# EAGLE design Slave_l293d (EAGLE 9.2.2)
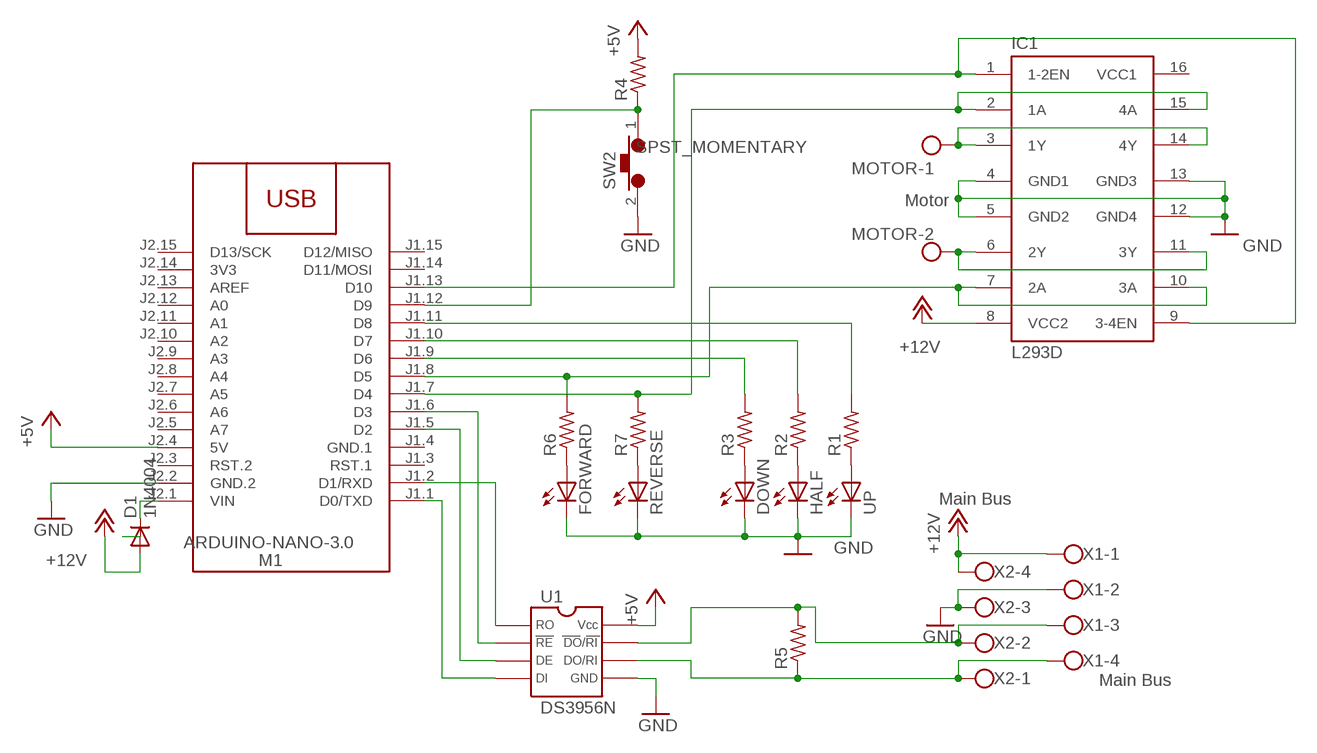
[diagram p0: schematic, sheet 1]

## Parts
D1  1N4004  [DO41-10]
DOWN  LED5MM  [LED5MM]
FORWARD  LED5MM  [LED5MM]
HALF  LED5MM  [LED5MM]
IC1  L293D  [DIL16]
M1  ARDUINO-NANO-3.0  [ARDUINO-NANO-3.0]
MOTOR  Motor  W237-102  [W237-102]
R1  FLIPFLOP-RES  [0805-THM]
R2  FLIPFLOP-RES  [0805-THM]
R3  FLIPFLOP-RES  [0805-THM]
R4  FLIPFLOP-RES  [0805-THM]
R5  FLIPFLOP-RES  [0805-THM]
R6  FLIPFLOP-RES  [0805-THM]
R7  FLIPFLOP-RES  [0805-THM]
REVERSE  LED5MM  [LED5MM]
SW2  SPST_MOMENTARY  [2PIN]
U1  DS3956N  [DIL08]
UP  LED5MM  [LED5MM]
X1  Main Bus  W237-4  [W237-4]
X2  Main Bus  W237-4  [W237-4]

## Nets
+5V: M1.J2.4(5V) R4.2 U1.8(VCC)
+12V: D1.A IC1.8(VCC2) X1.1 X2.4
GND: DOWN.K(C) FORWARD.K(C) HALF.K(C) IC1.4(GND1) IC1.5(GND2) IC1.12(GND4) IC1.13(GND3) M1.J2.2(GND.2) REVERSE.K(C) SW2.2 U1.5(GND) UP.K(C) X1.2 X2.3
N$1: R1.1 UP.A
N$2: HALF.A R2.1
N$3: DOWN.A R3.1
N$4: M1.J1.12(D9) R4.1 SW2.1
N$5: R5.1 U1.6(DO/RI) X1.4 X2.1
N$6: R5.2 U1.7(_DO/RI_) X1.3 X2.2
N$7: M1.J1.6(D3) U1.2(_RE_)
N$8: M1.J1.5(D2) U1.3(DE)
N$9: M1.J1.2(D1/RXD) U1.1(RO)
N$10: M1.J1.1(D0/TXD) U1.4(DI)
N$11: M1.J1.9(D6) R3.2
N$12: M1.J1.10(D7) R2.2
N$13: M1.J1.11(D8) R1.2
N$16: D1.C M1.J2.1(VIN)
N$18: FORWARD.A R6.1
N$19: R7.1 REVERSE.A
N$20: IC1.2(1A) IC1.15(4A) M1.J1.7(D4) R7.2
N$21: IC1.3(1Y) IC1.14(4Y) MOTOR.1
N$22: IC1.1(1-2EN) IC1.9(3-4EN) M1.J1.13(D10)
N$24: IC1.6(2Y) IC1.11(3Y) MOTOR.2
N$25: IC1.7(2A) IC1.10(3A) M1.J1.8(D5) R6.2
Unconnected: M1.J1.3(RST.1) M1.J1.14(D11/MOSI) M1.J1.15(D12/MISO) M1.J2.3(RST.2) M1.J2.5(A7) M1.J2.6(A6) M1.J2.7(A5) M1.J2.8(A4) M1.J2.9(A3) M1.J2.10(A2) M1.J2.11(A1) M1.J2.12(A0) M1.J2.13(AREF) M1.J2.15(D13/SCK)

## Power pins joined to a net without a drawn wire
3V3: M1.J2.14(3V3)
GND.1: M1.J1.4(GND.1)
VCC1: IC1.16(VCC1)

## Library data of the parts
D1 = adafruit:1N4004: DIODE General purpose 1N400x type rectifier (With bigger pads) http://www.ladyada.net/library/pcb/eaglelibrary.html
DOWN FORWARD HALF REVERSE UP = adafruit:LED: LED OSRAM: - CHIPLED LG R971, LG N971, LY N971, LG Q971, LY Q971, LO R971, LY R971 LH N974, LH R974 LS Q976, LO Q976, LY Q976 LO Q996 - Hyper CHIPLED LW Q18S LB Q993, LB Q99A, LB R99A - SideLED LS A670, LO A670, LY A670, LG A670, LP A670 LB A673, LV A673, LT A673, LW A673 LH A674 LY A675 LS A676, LA A676, LO A676, LY A676, LW A676 LS A679, LY A679, LG A679 - Hyper Micro SIDELED® LS Y876, LA Y876, LO Y876, LY Y876 LT Y87S - SmartLED LW L88C, LW L88S LB L89C, LB L89S, LG L890 LS L89K, LO L89K, LY L89K LS L896, LA L896, LO L896, LY L896 - TOPLED LS T670, LO T670, LY T670, LG T670, LP T670 LSG T670, LSP T670, LSY T670, LOP T670, LYG T670 LG T671, LOG T671, LSG T671 LB T673, LV T673, LT T673, LW T673 LH T674 LS T676, LA T676, LO T676, LY T676, LB T676, LH T676, LSB T676, LW T676 LB T67C, LV T67C, LT T67C, LS T67K, LO T67K, LY T67K, LW E67C LS E67B, LA E67B, LO E67B, LY E67B, LB E67C, LV E67C, LT E67C LW T67C LS T679, LY T679, LG T679 LS T770, LO T770, LY T770, LG T770, LP T770 LB T773, LV T773, LT T773, LW T773 LH T774 LS E675, LA E675, LY E675, LS T675 LS T776, LA T776, LO T776, LY T776, LB T776 LHGB T686 LT T68C, LB T68C - Hyper Mini TOPLED® LB M676 - Mini TOPLED Santana® LG M470 LS M47K, LO M47K, LY M47K Source: http://www.osram.convergy.de/
IC1 = st-microelectronics:L293D: PUSH-PULL 4 CHANNEL DRIVER; MPN: L293D; OC_FARNELL: 9589619; OC_NEWARK: 56P8249
M1 = diy-modules:ARDUINO-NANO-3.0: Arduino Nano 3.0
MOTOR = con-wago-500:W237-102: WAGO SCREW CLAMP; MPN: 237-102; OC_FARNELL: unknown; OC_NEWARK: 70K9898
R1-R7 = adafruit:FLIPFLOP-RES: Flip Flop resistor An 0805 resistor inside a standard 1/4W 5% resistor. Makes for easy mods
SW2 = OffBoardSwitches:SPST_MOMENTARY: A 2 pin 0.1" header with a button symbol for mounting buttons off board with the correct symbol in the schematic
U1 = DS3695N_RS485_Transceiver:DS3956N: DS35695N rs485 Transiever
X1 X2 = con-wago-500:W237-4: WAGO SCREW CLAMP; OC_FARNELL: unknown; OC_NEWARK: unknown

## Net classes
0 default: width 0.025 mm

## Board
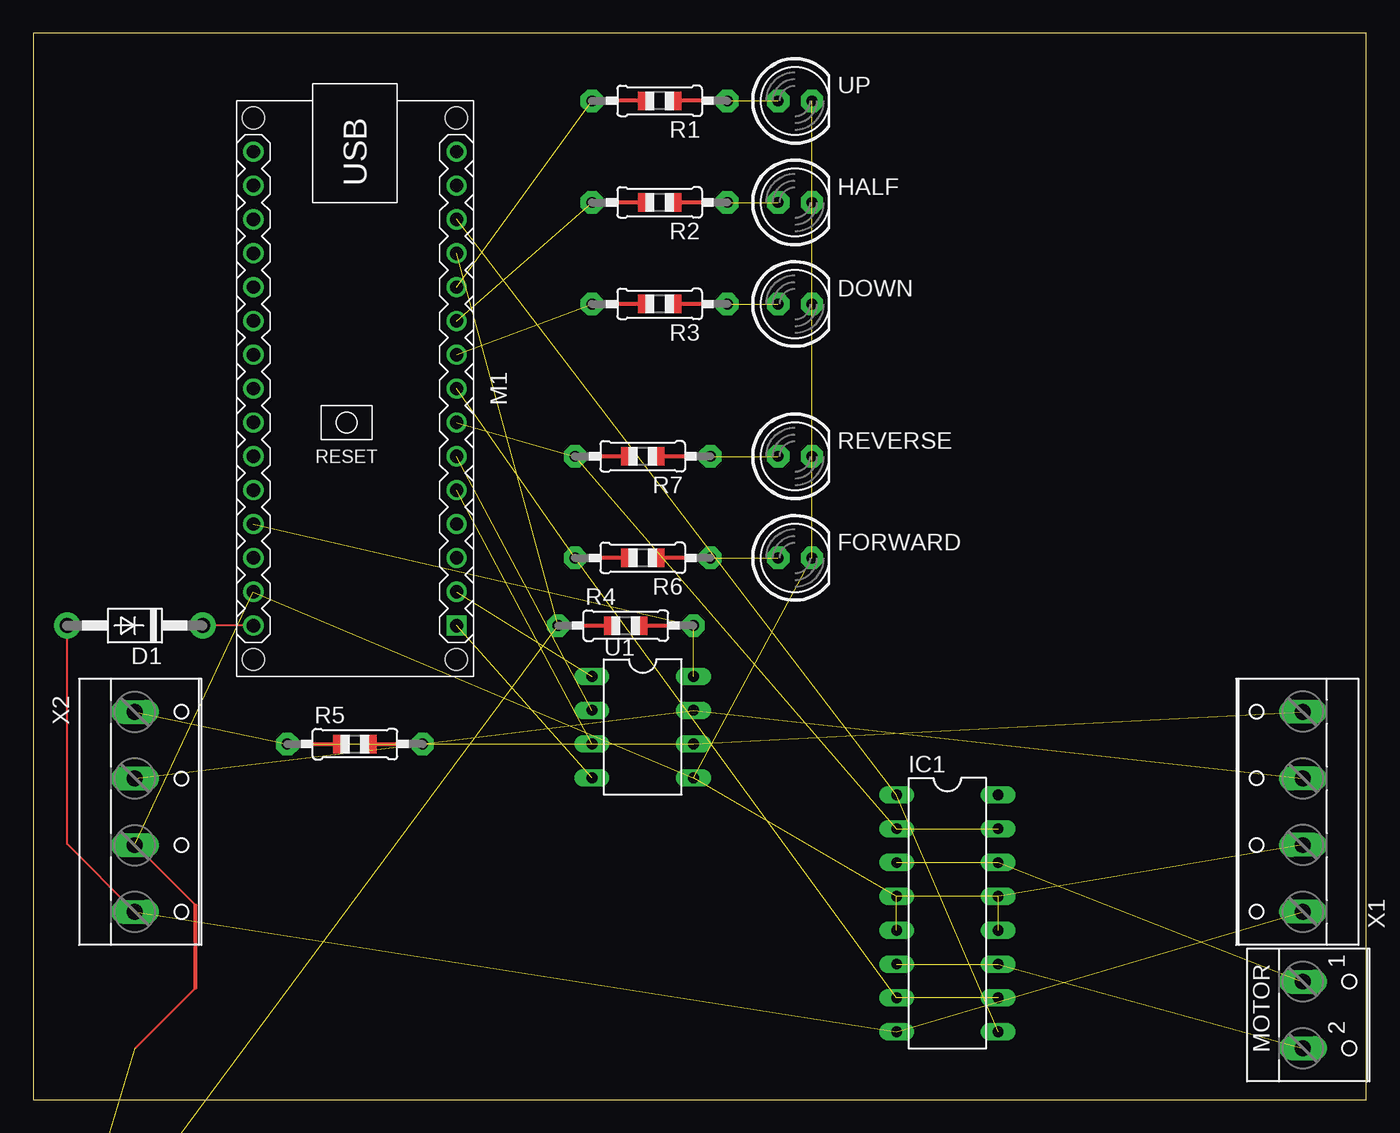
[diagram p1: board, top side]

Size 100 x 80 mm. Coordinates in mm from the lower left corner, seen from the top.
Outline: 0,0 100,0 100,80 0,80 0,0
Copper layers (1*16): Top 0.035mm / dielectric 1.5mm / Bottom 0.035mm
Design rules "default": minimum track width 6mil, minimum drill 0.35mm, track to track 6mil, track to pad 6mil, pad to pad 6mil, via to via 6mil, smd to smd 6mil, copper to edge 40mil, drill to drill 6mil, minimum pad ring 10mil, minimum via ring 8mil, stop-mask expansion 4mil, vias tented up to drill 0mil, thermal gap 10mil

### Footprints (pad centres in the part's own frame; a part is rotated, then mirrored left to right if it is on the bottom)
DO41-10 = drill 1.118 pad 1.93: A 5.08,0; C -5.08,0
LED5MM = drill 0.813 pad 1.676 octagon: A -1.27,0; K 1.27,0
DIL16 = drill 0.813 long: 1 -8.89,-3.81; 2 -6.35,-3.81; 3 -3.81,-3.81; 4 -1.27,-3.81; 5 1.27,-3.81; 6 3.81,-3.81; 7 6.35,-3.81; 8 8.89,-3.81; 9 8.89,3.81; 10 6.35,3.81; 11 3.81,3.81; 12 1.27,3.81; 13 -1.27,3.81; 14 -3.81,3.81; 15 -6.35,3.81; 16 -8.89,3.81
ARDUINO-NANO-3.0 = drill 1 square: J1.1 17.78,7.62 | drill 1: J1.2 15.24,7.62; J1.3 12.7,7.62; J1.4 10.16,7.62; J1.5 7.62,7.62; J1.6 5.08,7.62; J1.7 2.54,7.62; J1.8 0,7.62; J1.9 -2.54,7.62; J1.10 -5.08,7.62; J1.11 -7.62,7.62; J1.12 -10.16,7.62; J1.13 -12.7,7.62; J1.14 -15.24,7.62; J1.15 -17.78,7.62; J2.1 17.78,-7.62; J2.2 15.24,-7.62; J2.3 12.7,-7.62; J2.4 10.16,-7.62; J2.5 7.62,-7.62; J2.6 5.08,-7.62; J2.7 2.54,-7.62; J2.8 0,-7.62; J2.9 -2.54,-7.62; J2.10 -5.08,-7.62; J2.11 -7.62,-7.62; J2.12 -10.16,-7.62; J2.13 -12.7,-7.62; J2.14 -15.24,-7.62; J2.15 -17.78,-7.62 | hole 1.651: -20.32,7.62; -20.32,-7.62; 20.32,-7.62; 20.32,7.62
W237-102 = drill 1.194 long: 1 -2.5,-1.27; 2 2.5,-1.27
0805-THM = drill 0.813 pad 1.676 octagon: 1 -5.08,0; 2 5.08,0
2PIN = drill 1 pad 1.5 octagon: 1 1.27,0; 2 -1.27,0
DIL08 = drill 0.813 long: 1 -3.81,-3.81; 2 -1.27,-3.81; 3 1.27,-3.81; 4 3.81,-3.81; 5 3.81,3.81; 6 1.27,3.81; 7 -1.27,3.81; 8 -3.81,3.81
W237-4 = drill 1.194 long: 1 -7.5,-1.27; 2 -2.5,-1.27; 3 2.5,-1.27; 4 7.5,-1.27

### Placement (x,y rotation side)
D1  7.62,35.56 180 top
DOWN  57.15,59.69 0 top
FORWARD  57.15,40.64 0 top
HALF  57.15,67.31 0 top
IC1  68.58,13.97 270 top
M1  24.13,53.34 270 top
MOTOR  96.52,6.35 270 top
R1  46.99,74.93 180 top
R2  46.99,67.31 180 top
R3  46.99,59.69 180 top
R4  44.45,35.56 0 top
R5  24.13,26.67 0 top
R6  45.72,40.64 180 top
R7  45.72,48.26 180 top
REVERSE  57.15,48.26 0 top
SW2  5.08,-8.89 0 top  (outside the outline)
U1  45.72,27.94 270 top
UP  57.15,74.93 0 top
X1  93.98,21.59 90 top
X2  8.89,21.59 270 top

### Tracks (layer width: path | path; a pad name or v marks a point on that pad's centre or on a via)
+5V  (2 unrouted)
+12V  (2 unrouted)
  Top 0.152: X2.4 2.54,19.17 D1.A
GND  (13 unrouted)
  Top 0.152: 12.18,8.38 7.64,3.85 | 12.18,14.56 7.64,19.09 X2.3
  Top 0.305: 12.18,8.38 12.18,14.56
N$1  (1 unrouted)
N$2  (1 unrouted)
N$3  (1 unrouted)
N$4  (2 unrouted)
N$5  (3 unrouted)
N$6  (3 unrouted)
N$7  (1 unrouted)
N$8  (1 unrouted)
N$9  (1 unrouted)
N$10  (1 unrouted)
N$11  (1 unrouted)
N$12  (1 unrouted)
N$13  (1 unrouted)
N$16
  Top 0.152: M1.J2.1 D1.C
N$18  (1 unrouted)
N$19  (1 unrouted)
N$20  (3 unrouted)
N$21  (2 unrouted)
N$22  (2 unrouted)
N$24  (2 unrouted)
N$25  (3 unrouted)